# Altium project PROC054D_MMW_CAS_RF_EVM.PrjPcb (part 9 of 9)

## Sheet PROC054D_EVM_Hardware.SchDoc: HAWRdwAWRe
size 558 x 431 mm; Date: Not shown in title block; ApprovedBy: Not shown in title block; CheckedBy: Not shown in title block; Author: Not shown in title block; CompanyName: Not shown in title block; DrawnBy: a0271760; Engineer: Not shown in title block; Organization: Not shown in title block; Address1: Not shown in title block; Address2: Not shown in title block; Address3: Not shown in title block; Address4: Not shown in title block; DocumentNumber: 18; Revision: Use project pAWRameter SCH_Rev; SheetNumber: 18; SheetTotal: 19; PageSetup: Record=PageOptions|CenterHorizontal=True|CenterVertical=True|PrintScale=1.00|XCorrection=1.00|YCorrection=1.00|PrintKind=0|BorderSize=5000000|LeftOffset=0|BottomOffset=0|Orientation=2|PaperLength=1000|PaperWidth=1000|Scale=100|PaperSource=15|PrintQuality=600|MediaType=1|DitherType=10|PaperKind=Letter|PrintScaleMode=1; CurrentTime: Not shown in title block; CurrentDate: Not shown in title block; Time: Not shown in title block; DocumentFullPathAndName: Not shown in title block; DocumentName: Not shown in title block; ModifiedDate: Not shown in title block; ImagePath: Not shown in title block
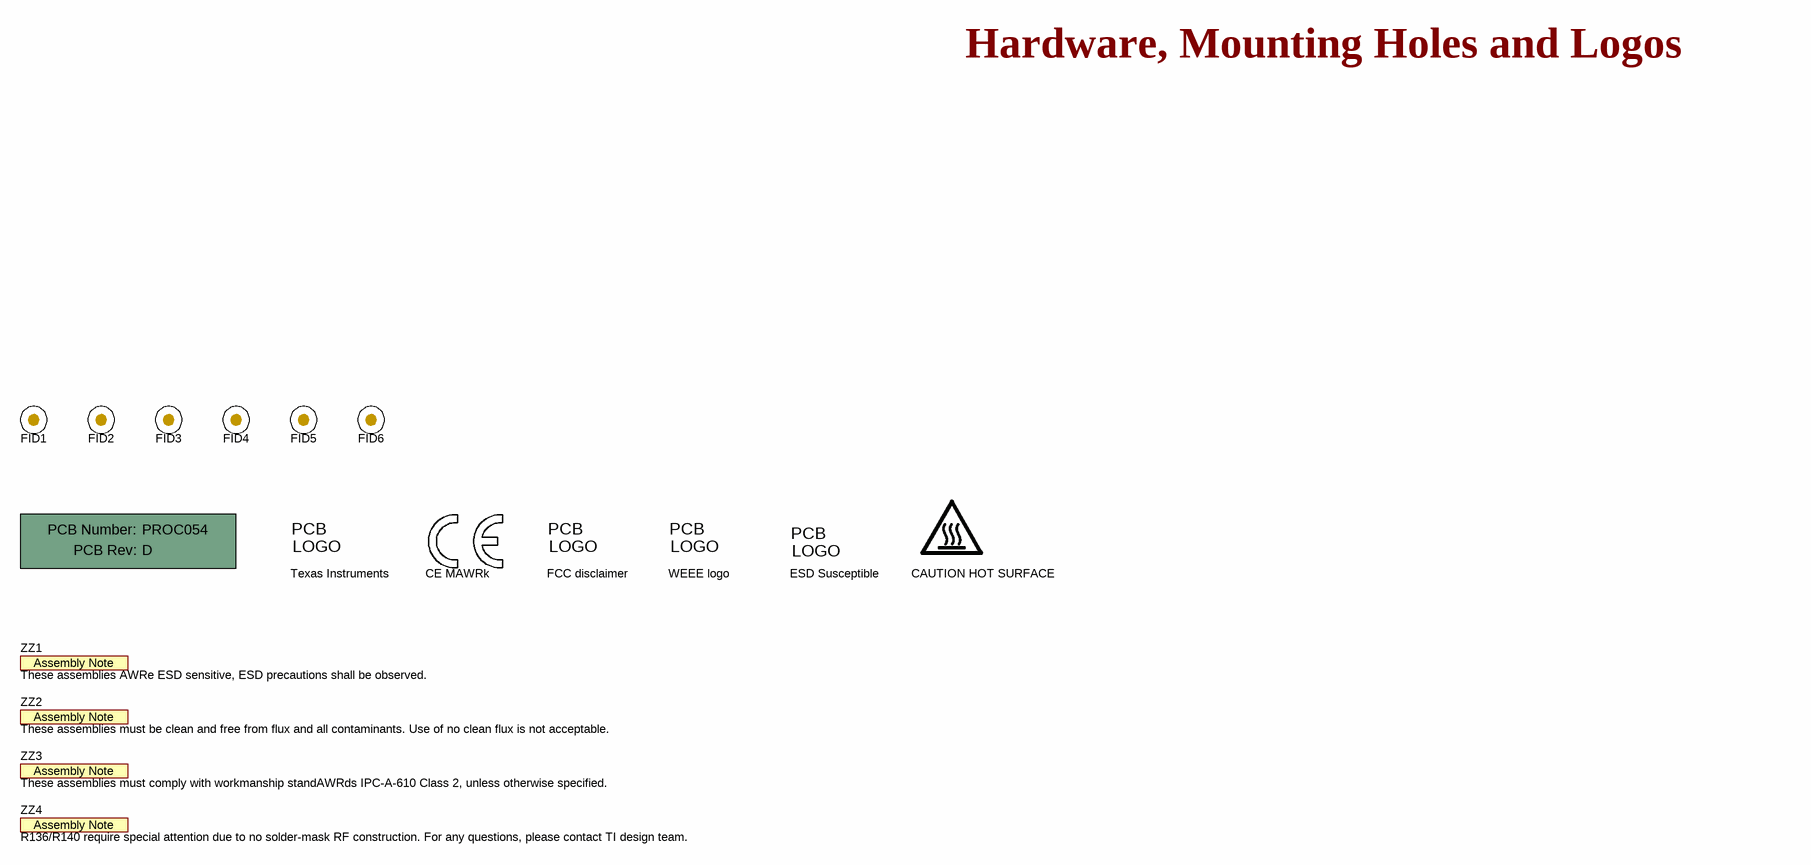
[diagram p41: PROC054D_EVM_Hardware.SchDoc]

### Parts
!PCB1  Printed Circuit Board  (value not drawn)  (mechanical)
FID1  Fiducial  [Fiducial10-20]  (value not drawn)
FID2  Fiducial  [Fiducial10-20]  (value not drawn)
FID3  Fiducial  [Fiducial10-20]  (value not drawn)
FID4  Fiducial  [Fiducial10-20]  (value not drawn)
FID5  Fiducial  [Fiducial10-20]  (value not drawn)
FID6  Fiducial  [Fiducial10-20]  (value not drawn)
Logo1  CE MAWRk  [CE_Mark_5mm]  (no BOM)
Logo2  Texas Instruments  [TI_Stacked_Overlay_Small]  (no BOM)
Logo3  FCC disclaimer  [FCC_disclaimer]  (no BOM)
Logo4  WEEE logo  [WEEE_Minimum]  (no BOM)
Logo5  ESD Susceptible  [ESD_Overlay_Large]  (no BOM)
LOGO6  CAUTION HOT SURFACE  [IEC_HotSurface_Large]  (no BOM)
ZZ1  These assemblies AWRe ESD sensitive, ESD precautions shall be observed.  [AssemblyNote]  (no BOM)
ZZ2  These assemblies must be clean and free from flux and all contaminants. Use of no clean flux is not acceptable.  [AssemblyNote]  (no BOM)
ZZ3  These assemblies must comply with workmanship standAWRds IPC-A-610 Class 2, unless otherwise specified.  [AssemblyNote]  (no BOM)
ZZ4  R136/R140 require special attention due to no solder-mask RF construction. For any questions, please contact TI design team.  [AssemblyNote]  (no BOM)

### Notes on the sheet
- Hardware, Mounting Holes and Logos
- Drawn By:
- SVN Rev:
- Number:
- TID #:
- Orderable:
- Rev:
- Sheet Title:
- File:
- Project Title:
- Designed for:
- Assembly VAWRiant:
- Mod. Date:
- Sheet:
- Size:
- of
- C
- http://www.ti.com
- Texas Instruments and/or its licensors do not wAWRrant the accuracy or completeness of this specification or any information contained therein. Texas Instruments and/or its licensors do not wAWRrant that this design will meet the specifications, will be suitable for your application or fit for any pAWRticulAWR purpose, or will operate in an implementation. Texas Instruments and/or its licensors do not wAWRrant that the design is production worthy. You should completely validate and test your design implementation to confirm the system functionality for your application.
- Engineer:
- Contact:
- © Texas Instruments
- (in symbol CMP-0003618-2) PCB Number:; PCB Rev:
- (in symbol CMP-0074769-1) PCB; LOGO
- (in symbol CMP-0074838-1) PCB; LOGO
- (in symbol CMP-0074840-1) PCB; LOGO
- (in symbol CMP-0074847-1) PCB; LOGO

### Library data of the parts
!PCB1 = CMP-0003618-2: Manufacturer: Any; PartNumber: PROC054; CompType: PCB; RoHS: O; MountType: N/A; Publisher: Texas Instruments; LatestRevisionDate: 2017-03-09; Key: PCB
FID1-FID6 = CMP-0077181-1: Fiducial mark.  There is nothing to buy or mount.; CompType: Fiducial; Manufacturer: N/A; MountType: N/A; PackageReference: N/A; PartNumber: N/A; ClassName: FiducialMark; Library Reference: Fiducial
Logo1 = CMP-0074844-1: CE Mark; SymbolCreator: a0412235; Published: 2009-03-03; Publisher: Texas Instruments; LatestRevisionDate: 2017-07-06; Lib Reference: CE Mark; PartNumber: CE Mark; Library Reference: CE Mark
Logo2 = CMP-0074838-1: Texas Instrument Corporate Signature; SymbolCreator: a0412235; Lib Reference: TI_Logo; Library Reference: Logo; SymbolVersion: 2011-08-22; Published: 2009-03-03; Publisher: Texas Instruments; ClassName: Logo; LatestRevisionDate: 2017-07-06; PartNumber: Texas Instruments
Logo3 = CMP-0074847-1: FCC_disclaimer; Library Reference: Logo; Published: 2009-03-03; Publisher: Texas Instruments; LatestRevisionDate: 2017-07-06; Lib Reference: FCC_disclaimer; PartNumber: FCC disclaimer
Logo4 = CMP-0074769-1: Library Reference: WEEE logo; Lib Reference: WEEE logo; PartNumber: WEEE logo
Logo5 = CMP-0074840-1: ESD Susceptible Symbol; SymbolCreator: a0412235; Lib Reference: ESD_Susceptible; Library Reference: Logo; Publisher: Texas Instruments; SymbolVersion: 2011-08-22; Published: 2009-03-03; LatestRevisionDate: 2017-07-06; PartNumber: ESD Susceptible
LOGO6 = CMP-0074837-1: IEC 61010-1 Hot Surface Warning; SymbolCreator: a0412235; Library Reference: IEC_HotSurface; Publisher: Texas Instruments; SymbolVersion: 2011-08-22; Published: 2009-03-03; Lib Reference: IEC_HotSurface; LatestRevisionDate: 2017-07-06; PartNumber: CAUTION HOT SURFACE
ZZ1 = CMP-0077236-1: These assemblies are ESD sensitive, ESD precautions shall be observed.; CompType: AssemblyNote; ClassName: AssemblyNote; Publisher: Texas Instruments; LatestRevisionDate: 2017-08-10; Key: AssemblyNote
ZZ2 = CMP-0077237-1: CompType: AssemblyNote; ClassName: AssemblyNote; Publisher: Texas Instruments; LatestRevisionDate: 2017-08-10; Key: AssemblyNote
ZZ3 = CMP-0077238-1: These assemblies must comply with workmanship standards IPC-A-610 Class 2, unless otherwise specified.; CompType: AssemblyNote; ClassName: AssemblyNote; Publisher: Texas Instruments; LatestRevisionDate: 2017-08-10; Key: AssemblyNote
ZZ4 = CMP-0077238-1: CompType: AssemblyNote; ClassName: AssemblyNote; Publisher: Texas Instruments; LatestRevisionDate: 2017-08-10; Key: AssemblyNote

## Sheet PROC054D_Revision_History.SchDoc: Revision History
size 558 x 431 mm; Date: Not shown in title block; ApprovedBy: Not shown in title block; CheckedBy: Not shown in title block; Author: Not shown in title block; CompanyName: Not shown in title block; DrawnBy: a0271760; Engineer: Not shown in title block; Organization: Not shown in title block; Address1: Not shown in title block; Address2: Not shown in title block; Address3: Not shown in title block; Address4: Not shown in title block; DocumentNumber: 19; Revision: Use project pAWRameter SCH_Rev; SheetNumber: 19; SheetTotal: 19; PageSetup: Record=PageOptions|CenterHorizontal=True|CenterVertical=True|PrintScale=1.00|XCorrection=1.00|YCorrection=1.00|PrintKind=0|BorderSize=5000000|LeftOffset=0|BottomOffset=0|Orientation=2|PaperLength=1000|PaperWidth=1000|Scale=100|PaperSource=15|PrintQuality=600|MediaType=1|DitherType=10|PaperKind=Letter|PrintScaleMode=1; CurrentTime: Not shown in title block; CurrentDate: Not shown in title block; Time: Not shown in title block; DocumentFullPathAndName: Not shown in title block; DocumentName: Not shown in title block; ModifiedDate: Not shown in title block; ImagePath: Not shown in title block
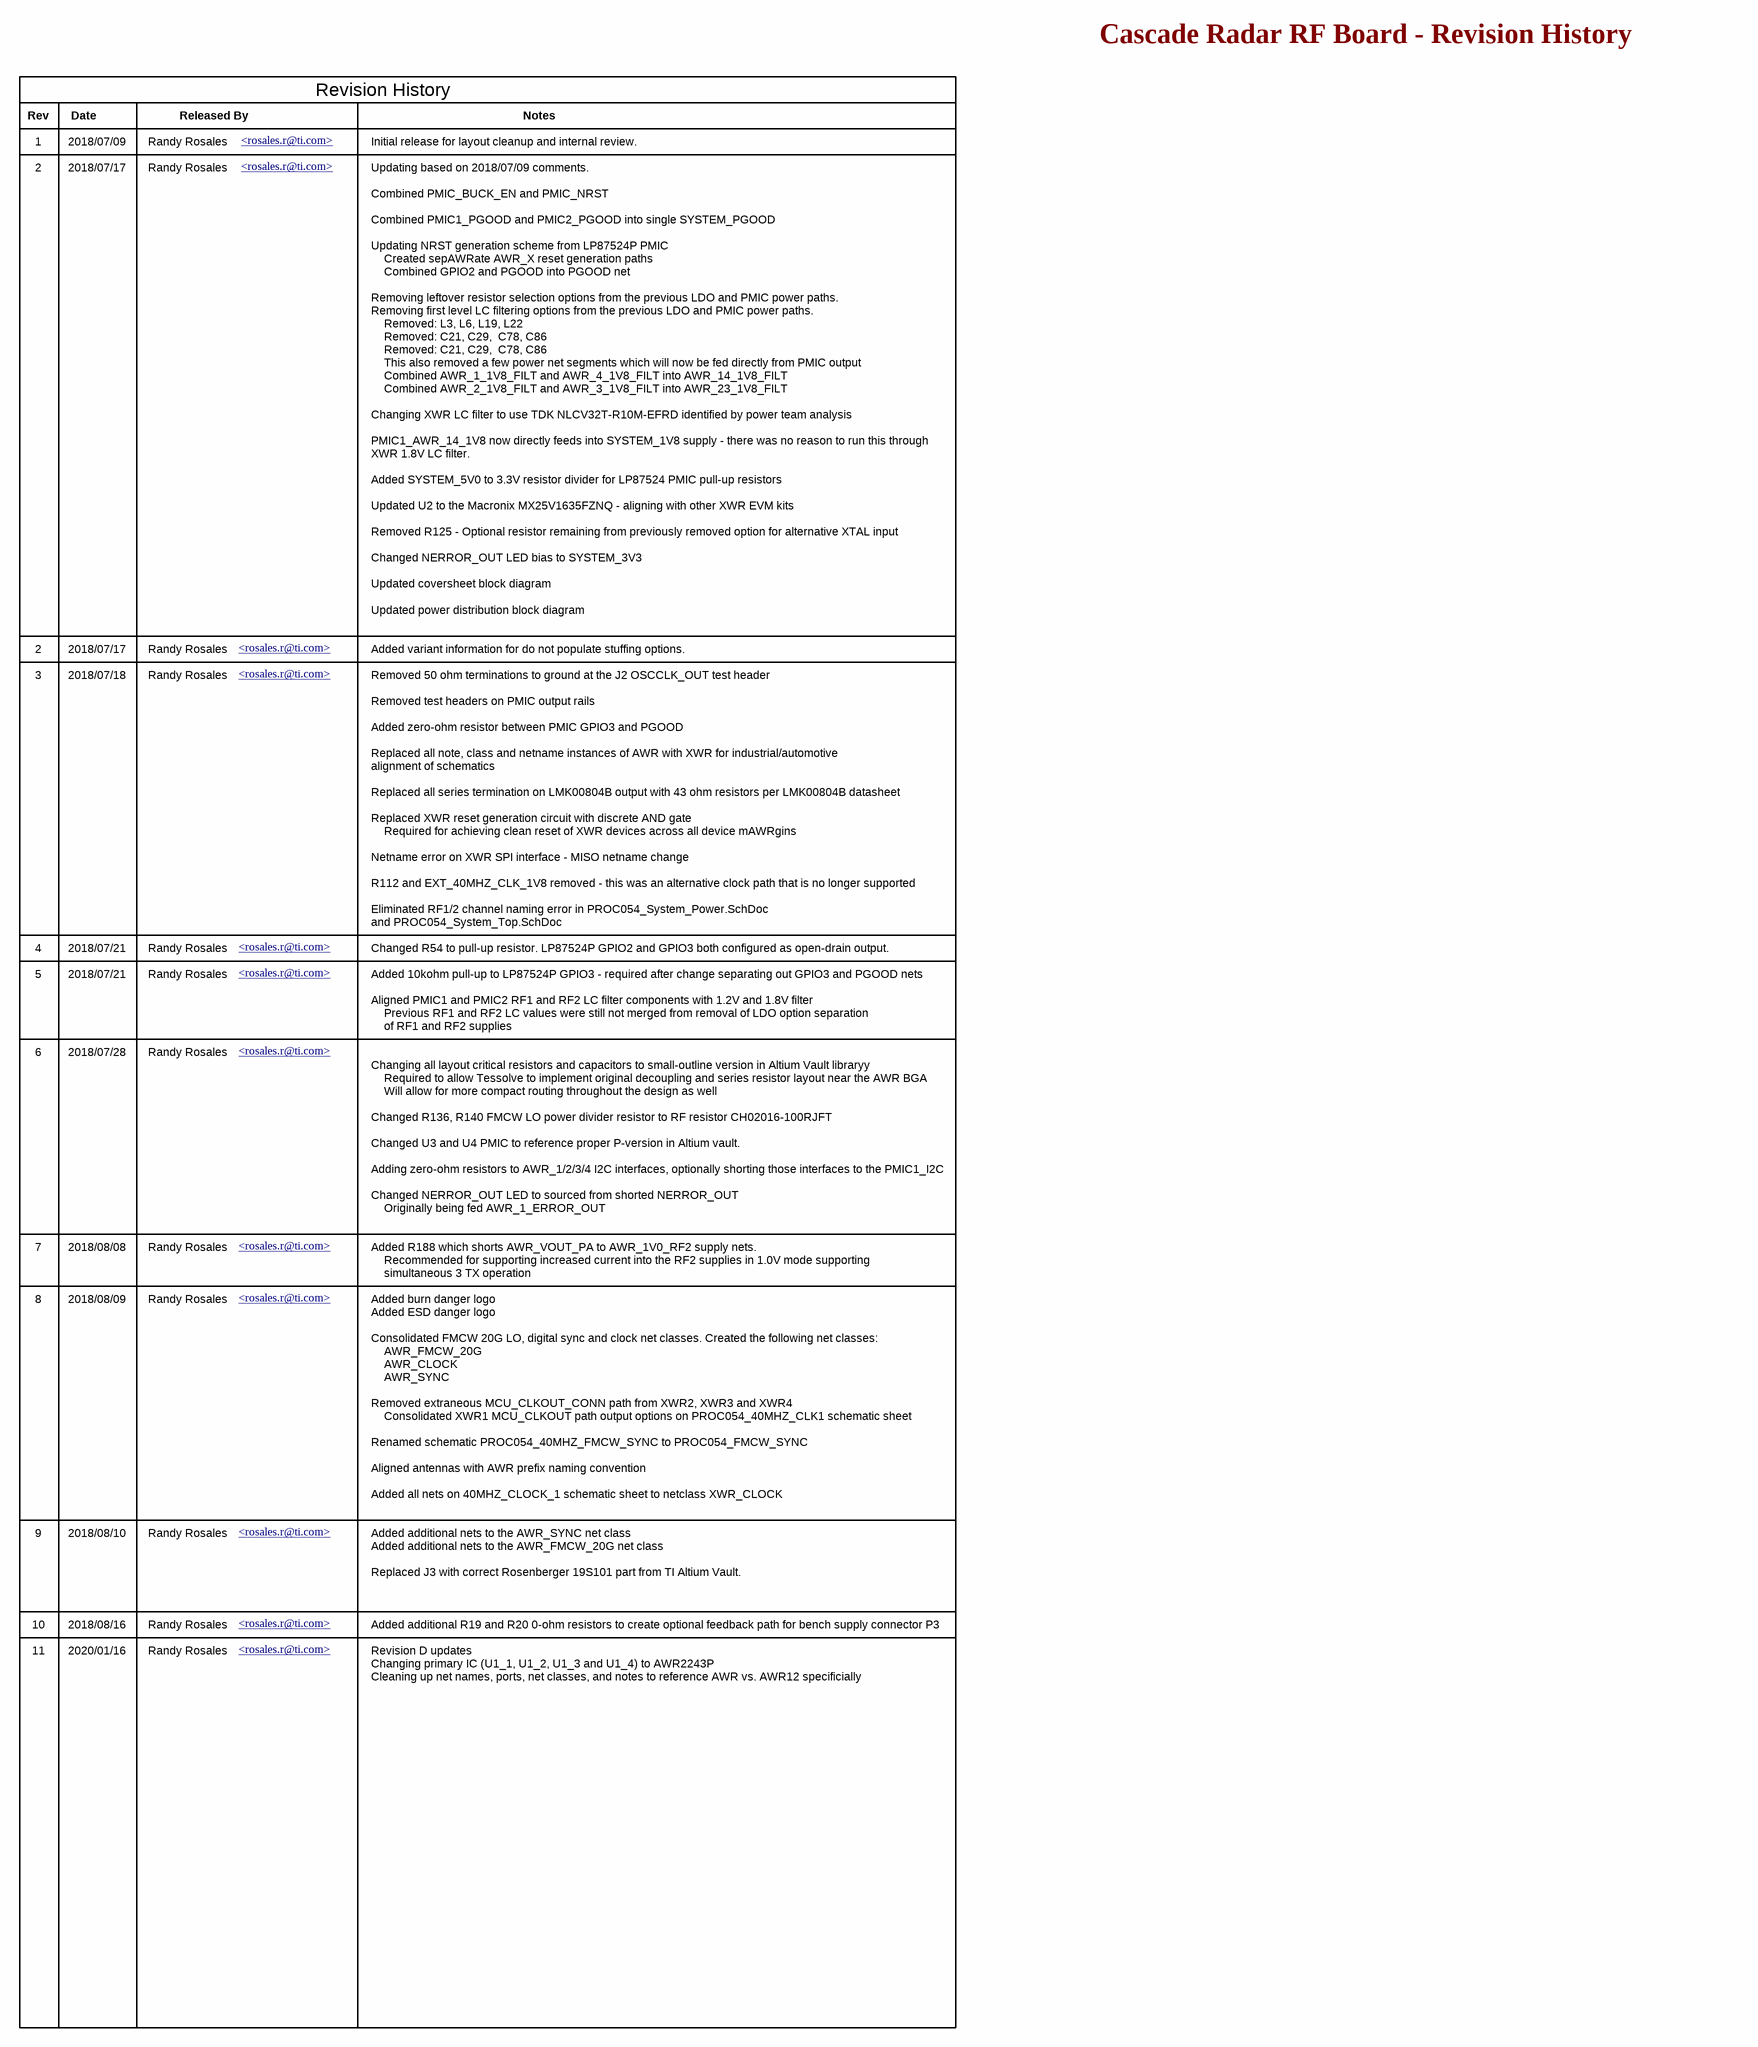
[diagram p42: PROC054D_Revision_History.SchDoc]

### Notes on the sheet
- Cascade Radar RF Board - Revision History
- Rev
- Date
- Released By
- Revision History
- Notes
- 1
- 2
- 2018/07/09
- 2018/07/17
- Randy Rosales
- <rosales.r@ti.com> <rosales.r@ti.com>
- Initial release for layout cleanup and internal review.
- Updating based on 2018/07/09 comments.
- Combined PMIC_BUCK_EN and PMIC_NRST
- Updating NRST generation scheme from LP87524P PMIC
- Combined PMIC1_PGOOD and PMIC2_PGOOD into single SYSTEM_PGOOD
- Created sepAWRate AWR_X reset generation paths
- Removing leftover resistor selection options from the previous LDO and PMIC power paths.
- Removing first level LC filtering options from the previous LDO and PMIC power paths.
- Removed: L3, L6, L19, L22
- Combined GPIO2 and PGOOD into PGOOD net
- Removed: C21, C29,  C78, C86
- This also removed a few power net segments which will now be fed directly from PMIC output
- Combined AWR_1_1V8_FILT and AWR_4_1V8_FILT into AWR_14_1V8_FILT
- Combined AWR_2_1V8_FILT and AWR_3_1V8_FILT into AWR_23_1V8_FILT
- Changing XWR LC filter to use TDK NLCV32T-R10M-EFRD identified by power team analysis
- PMIC1_AWR_14_1V8 now directly feeds into SYSTEM_1V8 supply - there was no reason to run this through
- XWR 1.8V LC filter.
- Updated U2 to the Macronix MX25V1635FZNQ - aligning with other XWR EVM kits
- Added SYSTEM_5V0 to 3.3V resistor divider for LP87524 PMIC pull-up resistors
- Removed R125 - Optional resistor remaining from previously removed option for alternative XTAL input
- Changed NERROR_OUT LED bias to SYSTEM_3V3
- Updated coversheet block diagram
- Updated power distribution block diagram
- Added variant information for do not populate stuffing options.
- 3
- 2018/07/18
- Removed 50 ohm terminations to ground at the J2 OSCCLK_OUT test header
- Removed test headers on PMIC output rails
- Added zero-ohm resistor between PMIC GPIO3 and PGOOD
- Replaced all note, class and netname instances of AWR with XWR for industrial/automotive
- alignment of schematics
- Replaced all series termination on LMK00804B output with 43 ohm resistors per LMK00804B datasheet
- Replaced XWR reset generation circuit with discrete AND gate
- Required for achieving clean reset of XWR devices across all device mAWRgins
- Netname error on XWR SPI interface - MISO netname change
- R112 and EXT_40MHZ_CLK_1V8 removed - this was an alternative clock path that is no longer supported
- Eliminated RF1/2 channel naming error in PROC054_System_Power.SchDoc
- 4
- 5
- 2018/07/21
- Changed R54 to pull-up resistor. LP87524P GPIO2 and GPIO3 both configured as open-drain output.
- and PROC054_System_Top.SchDoc
- Added 10kohm pull-up to LP87524P GPIO3 - required after change separating out GPIO3 and PGOOD nets
- Aligned PMIC1 and PMIC2 RF1 and RF2 LC filter components with 1.2V and 1.8V filter
- Previous RF1 and RF2 LC values were still not merged from removal of LDO option separation
- of RF1 and RF2 supplies
- 6
- 2018/07/28
- Changing all layout critical resistors and capacitors to small-outline version in Altium Vault libraryy
- Required to allow Tessolve to implement original decoupling and series resistor layout near the AWR BGA
- Will allow for more compact routing throughout the design as well
- Adding zero-ohm resistors to AWR_1/2/3/4 I2C interfaces, optionally shorting those interfaces to the PMIC1_I2C
- Changed R136, R140 FMCW LO power divider resistor to RF resistor CH02016-100RJFT
- Changed U3 and U4 PMIC to reference proper P-version in Altium vault.
- Changed NERROR_OUT LED to sourced from shorted NERROR_OUT
- Originally being fed AWR_1_ERROR_OUT
- 7
- 8
- 2018/08/08
- 2018/08/09
- Added R188 which shorts AWR_VOUT_PA to AWR_1V0_RF2 supply nets.
- Added burn danger logo
- Recommended for supporting increased current into the RF2 supplies in 1.0V mode supporting
- simultaneous 3 TX operation
- Added ESD danger logo
- Consolidated FMCW 20G LO, digital sync and clock net classes. Created the following net classes:
- AWR_FMCW_20G
- AWR_CLOCK
- Removed extraneous MCU_CLKOUT_CONN path from XWR2, XWR3 and XWR4
- Consolidated XWR1 MCU_CLKOUT path output options on PROC054_40MHZ_CLK1 schematic sheet
- AWR_SYNC
- Renamed schematic PROC054_40MHZ_FMCW_SYNC to PROC054_FMCW_SYNC
- Aligned antennas with AWR prefix naming convention
- Added all nets on 40MHZ_CLOCK_1 schematic sheet to netclass XWR_CLOCK
- 9
- 2018/08/10
- Added additional nets to the AWR_SYNC net class
- Added additional nets to the AWR_FMCW_20G net class
- 10
- 2018/08/16
- Replaced J3 with correct Rosenberger 19S101 part from TI Altium Vault.
- Added additional R19 and R20 0-ohm resistors to create optional feedback path for bench supply connector P3
- 11
- 2020/01/16
- Changing primary IC (U1_1, U1_2, U1_3 and U1_4) to AWR2243P
- Cleaning up net names, ports, net classes, and notes to reference AWR vs. AWR12 specificially
- Revision D updates
- Drawn By:
- SVN Rev:
- Number:
- TID #:
- Orderable:
- Rev:
- Sheet Title:
- File:
- Project Title:
- Designed for:
- Assembly VAWRiant:
- Mod. Date:
- Sheet:
- Size:
- of
- C
- http://www.ti.com
- Texas Instruments and/or its licensors do not wAWRrant the accuracy or completeness of this specification or any information contained therein. Texas Instruments and/or its licensors do not wAWRrant that this design will meet the specifications, will be suitable for your application or fit for any pAWRticulAWR purpose, or will operate in an implementation. Texas Instruments and/or its licensors do not wAWRrant that the design is production worthy. You should completely validate and test your design implementation to confirm the system functionality for your application.
- Engineer:
- Contact:
- © Texas Instruments

## Nets that join several sheets
GND: PROC054D_40MHZ_Clock (29 pins), PROC054D_FMCW_Sync (14 pins), PROC054D_SMA_SMP_Connectors (10 pins), PROC054D_Temp_Sensor (9 pins), CASCADE_RF_BOARD/AWR_1 (20 pins), CASCADE_RF_BOARD/AWR_1 (92 pins), PROC054D_System_Power (12 pins), PROC054D_AWR_1_AWR_4_LP87524P (42 pins), PROC054D_System_3V3_Supply (5 pins), PROC054D_AWR_2_AWR_3_LP87524P (40 pins), PROC054D_AWR_1_AWR_4_LC_Filtering (35 pins), PROC054D_AWR_2_AWR_3_LC_Filtering (32 pins), PROC054D_System_LED (6 pins), CASCADE_RF_BOARD/AWR_1 (R182_1.1 R183_1.1 R184_1.1 R185_1.1), PROC054D_Host_Connector (104 pins), CASCADE_RF_BOARD/AWR_2 (20 pins), CASCADE_RF_BOARD/AWR_2 (92 pins), CASCADE_RF_BOARD/AWR_2 (R182_2.1 R183_2.1 R184_2.1 R185_2.1), CASCADE_RF_BOARD/AWR_3 (92 pins), CASCADE_RF_BOARD/AWR_3 (R182_3.1 R183_3.1 R184_3.1 R185_3.1), CASCADE_RF_BOARD/AWR_3 (20 pins), CASCADE_RF_BOARD/AWR_4 (20 pins), CASCADE_RF_BOARD/AWR_4 (R182_4.1 R183_4.1 R184_4.1 R185_4.1), CASCADE_RF_BOARD/AWR_4 (92 pins)
SYSTEM_1V8: PROC054D_40MHZ_Clock (C175.1 L34.1), PROC054D_AWR_1_AWR_4_LC_Filtering (C18.1 C19.1 C20.1 R35.2)
SYSTEM_3V3: PROC054D_40MHZ_Clock (C169.1 L33.1), PROC054D_FMCW_Sync (C181.1 L35.1), PROC054D_Temp_Sensor (7 pins), CASCADE_RF_BOARD/AWR_1 (R29_1.2), CASCADE_RF_BOARD/AWR_1 (C148_1.1 U1_1#2.R13), PROC054D_System_Power (20 pins), PROC054D_AWR_1_AWR_4_LP87524P (R46.1 R47.2), PROC054D_System_3V3_Supply (C203.1 U5.1), PROC054D_AWR_2_AWR_3_LP87524P (R70.1 R71.2), PROC054D_System_LED (R193.2 R195.2), CASCADE_RF_BOARD/AWR_1 (8 pins), PROC054D_Host_Connector (R150.2), CASCADE_RF_BOARD/AWR_2 (R29_2.2), CASCADE_RF_BOARD/AWR_2 (C148_2.1 U1_2#2.R13), CASCADE_RF_BOARD/AWR_2 (8 pins), CASCADE_RF_BOARD/AWR_3 (C148_3.1 U1_3#1.R13), CASCADE_RF_BOARD/AWR_3 (8 pins), CASCADE_RF_BOARD/AWR_3 (R29_3.2), CASCADE_RF_BOARD/AWR_4 (R29_4.2), CASCADE_RF_BOARD/AWR_4 (8 pins), CASCADE_RF_BOARD/AWR_4 (C148_4.1 U1_4#2.R13)
SYSTEM_5V0: PROC054D_AWR_1_AWR_4_LP87524P (10 pins), PROC054D_System_3V3_Supply (C202.1 U5.8), PROC054D_AWR_2_AWR_3_LP87524P (10 pins), PROC054D_System_LED (6 pins), PROC054D_Host_Connector (12 pins)
AWR_1_DIG_SYNCOUT: PROC054D_FMCW_Sync (R143.1), PROC054D_Host_Connector (R148.1)
AWR_1_MCU_CLKOUT: PROC054D_40MHZ_Clock (R213.1 R214.1), PROC054D_Host_Connector (J4.2)
AWR_1_NRST: PROC054D_System_Power (R208.2), PROC054D_System_LED (R198.2), PROC054D_Host_Connector (J4.85)
AWR_1_OSC_CLKOUT: PROC054D_40MHZ_Clock (R107.1), PROC054D_SMA_SMP_Connectors (R186.1)
AWR_1V0_RF1: CASCADE_RF_BOARD/AWR_1 (7 pins), CASCADE_RF_BOARD/AWR_2 (7 pins), CASCADE_RF_BOARD/AWR_3 (7 pins), CASCADE_RF_BOARD/AWR_4 (7 pins)
AWR_1V0_RF2: CASCADE_RF_BOARD/AWR_1 (R188_1.2), CASCADE_RF_BOARD/AWR_1 (C140_1.1 C141_1.1 U1_1#2.C2 U1_1#2.D2), CASCADE_RF_BOARD/AWR_2 (R188_2.2), CASCADE_RF_BOARD/AWR_2 (C140_2.1 C141_2.1 U1_2#2.C2 U1_2#2.D2), CASCADE_RF_BOARD/AWR_3 (C140_3.1 C141_3.1 U1_3#1.C2 U1_3#1.D2), CASCADE_RF_BOARD/AWR_3 (R188_3.2), CASCADE_RF_BOARD/AWR_4 (R188_4.2), CASCADE_RF_BOARD/AWR_4 (C140_4.1 C141_4.1 U1_4#2.C2 U1_4#2.D2)
AWR_1V2: CASCADE_RF_BOARD/AWR_1 (12 pins), CASCADE_RF_BOARD/AWR_2 (12 pins), CASCADE_RF_BOARD/AWR_3 (12 pins), CASCADE_RF_BOARD/AWR_4 (12 pins)
AWR_1V8: CASCADE_RF_BOARD/AWR_1 (14 pins), CASCADE_RF_BOARD/AWR_2 (14 pins), CASCADE_RF_BOARD/AWR_3 (14 pins), CASCADE_RF_BOARD/AWR_4 (14 pins)
AWR_2_NRST: PROC054D_System_Power (R209.2), PROC054D_System_LED (R199.2), PROC054D_Host_Connector (J4.109)
AWR_3_NRST: PROC054D_System_Power (R211.2), PROC054D_System_LED (R202.2), PROC054D_Host_Connector (J5.36)
AWR_3_OSC_CLKOUT: PROC054D_40MHZ_Clock (R109.1), PROC054D_SMA_SMP_Connectors (R187.1)
AWR_4_NRST: PROC054D_System_Power (R210.2), PROC054D_System_LED (R203.2), PROC054D_Host_Connector (J5.12)
BSS_LOGGER: CASCADE_RF_BOARD/AWR_1 (R14_1.1), CASCADE_RF_BOARD/AWR_2 (R14_2.1), CASCADE_RF_BOARD/AWR_3 (R14_3.1), CASCADE_RF_BOARD/AWR_4 (R14_4.1)
CSI2_CLK_N: CASCADE_RF_BOARD/AWR_1 (U1_1#1.J14), CASCADE_RF_BOARD/AWR_2 (U1_2#1.J14), CASCADE_RF_BOARD/AWR_3 (U1_3#2.J14), CASCADE_RF_BOARD/AWR_4 (U1_4#1.J14)
CSI2_CLK_P: CASCADE_RF_BOARD/AWR_1 (U1_1#1.J15), CASCADE_RF_BOARD/AWR_2 (U1_2#1.J15), CASCADE_RF_BOARD/AWR_3 (U1_3#2.J15), CASCADE_RF_BOARD/AWR_4 (U1_4#1.J15)
CSI2_TX0_N: CASCADE_RF_BOARD/AWR_1 (U1_1#1.G14), CASCADE_RF_BOARD/AWR_2 (U1_2#1.G14), CASCADE_RF_BOARD/AWR_3 (U1_3#2.G14), CASCADE_RF_BOARD/AWR_4 (U1_4#1.G14)
CSI2_TX0_P: CASCADE_RF_BOARD/AWR_1 (U1_1#1.G15), CASCADE_RF_BOARD/AWR_2 (U1_2#1.G15), CASCADE_RF_BOARD/AWR_3 (U1_3#2.G15), CASCADE_RF_BOARD/AWR_4 (U1_4#1.G15)
CSI2_TX1_N: CASCADE_RF_BOARD/AWR_1 (U1_1#1.H14), CASCADE_RF_BOARD/AWR_2 (U1_2#1.H14), CASCADE_RF_BOARD/AWR_3 (U1_3#2.H14), CASCADE_RF_BOARD/AWR_4 (U1_4#1.H14)
CSI2_TX1_P: CASCADE_RF_BOARD/AWR_1 (U1_1#1.H15), CASCADE_RF_BOARD/AWR_2 (U1_2#1.H15), CASCADE_RF_BOARD/AWR_3 (U1_3#2.H15), CASCADE_RF_BOARD/AWR_4 (U1_4#1.H15)
CSI2_TX2_N: CASCADE_RF_BOARD/AWR_1 (U1_1#1.K14), CASCADE_RF_BOARD/AWR_2 (U1_2#1.K14), CASCADE_RF_BOARD/AWR_3 (U1_3#2.K14), CASCADE_RF_BOARD/AWR_4 (U1_4#1.K14)
CSI2_TX2_P: CASCADE_RF_BOARD/AWR_1 (U1_1#1.K15), CASCADE_RF_BOARD/AWR_2 (U1_2#1.K15), CASCADE_RF_BOARD/AWR_3 (U1_3#2.K15), CASCADE_RF_BOARD/AWR_4 (U1_4#1.K15)
CSI2_TX3_N: CASCADE_RF_BOARD/AWR_1 (U1_1#1.L14), CASCADE_RF_BOARD/AWR_2 (U1_2#1.L14), CASCADE_RF_BOARD/AWR_3 (U1_3#2.L14), CASCADE_RF_BOARD/AWR_4 (U1_4#1.L14)
CSI2_TX3_P: CASCADE_RF_BOARD/AWR_1 (U1_1#1.L15), CASCADE_RF_BOARD/AWR_2 (U1_2#1.L15), CASCADE_RF_BOARD/AWR_3 (U1_3#2.L15), CASCADE_RF_BOARD/AWR_4 (U1_4#1.L15)
DIG_SYNCIN: CASCADE_RF_BOARD/AWR_1 (U1_1#1.N10), CASCADE_RF_BOARD/AWR_1 (R185_1.2), CASCADE_RF_BOARD/AWR_2 (U1_2#1.N10), CASCADE_RF_BOARD/AWR_2 (R185_2.2), CASCADE_RF_BOARD/AWR_3 (R185_3.2), CASCADE_RF_BOARD/AWR_3 (U1_3#2.N10), CASCADE_RF_BOARD/AWR_4 (U1_4#1.N10), CASCADE_RF_BOARD/AWR_4 (R185_4.2)
DIG_SYNCOUT: CASCADE_RF_BOARD/AWR_1 (R1_1.1 TP1_1.1), CASCADE_RF_BOARD/AWR_2 (R1_2.1 TP1_2.1), CASCADE_RF_BOARD/AWR_3 (R1_3.1 TP1_3.1), CASCADE_RF_BOARD/AWR_4 (R1_4.1 TP1_4.1)
EXT_DIG_SYNC: PROC054D_FMCW_Sync (R142.1), PROC054D_Host_Connector (J4.64)
FMCW_CLKOUT: CASCADE_RF_BOARD/AWR_1 (U1_1#1.B15), CASCADE_RF_BOARD/AWR_2 (U1_2#1.B15), CASCADE_RF_BOARD/AWR_3 (U1_3#2.B15), CASCADE_RF_BOARD/AWR_4 (U1_4#1.B15)
FMCW_SYNCIN1: CASCADE_RF_BOARD/AWR_1 (U1_1#1.B1), CASCADE_RF_BOARD/AWR_2 (U1_2#1.B1), CASCADE_RF_BOARD/AWR_3 (U1_3#2.B1), CASCADE_RF_BOARD/AWR_4 (U1_4#1.B1)
FMCW_SYNCOUT: CASCADE_RF_BOARD/AWR_1 (U1_1#1.D1), CASCADE_RF_BOARD/AWR_2 (U1_2#1.D1), CASCADE_RF_BOARD/AWR_3 (U1_3#2.D1), CASCADE_RF_BOARD/AWR_4 (U1_4#1.D1)
GPIO_0: CASCADE_RF_BOARD/AWR_1 (R16_1.2 U1_1#1.N4), CASCADE_RF_BOARD/AWR_2 (R16_2.2 U1_2#1.N4), CASCADE_RF_BOARD/AWR_3 (R16_3.2 U1_3#2.N4), CASCADE_RF_BOARD/AWR_4 (R16_4.2 U1_4#1.N4)
GPIO_1: CASCADE_RF_BOARD/AWR_1 (R17_1.2 U1_1#1.N7), CASCADE_RF_BOARD/AWR_2 (R17_2.2 U1_2#1.N7), CASCADE_RF_BOARD/AWR_3 (R17_3.2 U1_3#2.N7), CASCADE_RF_BOARD/AWR_4 (R17_4.2 U1_4#1.N7)
GPIO_2: CASCADE_RF_BOARD/AWR_1 (R18_1.2 U1_1#1.N13), CASCADE_RF_BOARD/AWR_2 (R18_2.2 U1_2#1.N13), CASCADE_RF_BOARD/AWR_3 (R18_3.2 U1_3#2.N13), CASCADE_RF_BOARD/AWR_4 (R18_4.2 U1_4#1.N13)
LVDS_FRCLK_N: CASCADE_RF_BOARD/AWR_1 (U1_1#1.M14), CASCADE_RF_BOARD/AWR_2 (U1_2#1.M14), CASCADE_RF_BOARD/AWR_3 (U1_3#2.M14), CASCADE_RF_BOARD/AWR_4 (U1_4#1.M14)
LVDS_FRCLK_P: CASCADE_RF_BOARD/AWR_1 (U1_1#1.M15), CASCADE_RF_BOARD/AWR_2 (U1_2#1.M15), CASCADE_RF_BOARD/AWR_3 (U1_3#2.M15), CASCADE_RF_BOARD/AWR_4 (U1_4#1.M15)
LVDS_VALID_N: CASCADE_RF_BOARD/AWR_1 (U1_1#1.N14), CASCADE_RF_BOARD/AWR_2 (U1_2#1.N14), CASCADE_RF_BOARD/AWR_3 (U1_3#2.N14), CASCADE_RF_BOARD/AWR_4 (U1_4#1.N14)
LVDS_VALID_P: CASCADE_RF_BOARD/AWR_1 (U1_1#1.N15), CASCADE_RF_BOARD/AWR_2 (U1_2#1.N15), CASCADE_RF_BOARD/AWR_3 (U1_3#2.N15), CASCADE_RF_BOARD/AWR_4 (U1_4#1.N15)
MCU_CLKOUT: CASCADE_RF_BOARD/AWR_1 (R5_1.1), CASCADE_RF_BOARD/AWR_2 (R5_2.1), CASCADE_RF_BOARD/AWR_3 (R5_3.1), CASCADE_RF_BOARD/AWR_4 (R5_4.1)
MSS_LOGGER: CASCADE_RF_BOARD/AWR_1 (R15_1.1), CASCADE_RF_BOARD/AWR_2 (R15_2.1), CASCADE_RF_BOARD/AWR_3 (R15_3.1), CASCADE_RF_BOARD/AWR_4 (R15_4.1)
NERROR_IN: CASCADE_RF_BOARD/AWR_1 (U1_1#1.P7), CASCADE_RF_BOARD/AWR_1 (R177_1.1), CASCADE_RF_BOARD/AWR_2 (U1_2#1.P7), CASCADE_RF_BOARD/AWR_2 (R177_2.1), CASCADE_RF_BOARD/AWR_3 (R177_3.1), CASCADE_RF_BOARD/AWR_3 (U1_3#2.P7), CASCADE_RF_BOARD/AWR_4 (U1_4#1.P7), CASCADE_RF_BOARD/AWR_4 (R177_4.1)
NERROR_OUT: CASCADE_RF_BOARD/AWR_1 (R9_1.1), PROC054D_System_LED (DS2.2), PROC054D_Host_Connector (6 pins), CASCADE_RF_BOARD/AWR_2 (R9_2.1), CASCADE_RF_BOARD/AWR_3 (R9_3.1), CASCADE_RF_BOARD/AWR_4 (R9_4.1)
NRST: CASCADE_RF_BOARD/AWR_1 (U1_1#1.P12), CASCADE_RF_BOARD/AWR_2 (U1_2#1.P12), CASCADE_RF_BOARD/AWR_3 (U1_3#2.P12), CASCADE_RF_BOARD/AWR_4 (U1_4#1.P12)
OSC_CLKOUT: CASCADE_RF_BOARD/AWR_1 (R2_1.1), CASCADE_RF_BOARD/AWR_2 (R2_2.1), CASCADE_RF_BOARD/AWR_3 (R2_3.1), CASCADE_RF_BOARD/AWR_4 (R2_4.1)
PMIC1_AWR_1_1V0: PROC054D_AWR_1_AWR_4_LP87524P (C61.1 C62.1 L13.2 R43.1), PROC054D_AWR_1_AWR_4_LC_Filtering (C25.1 C27.1 L4.1 L5.1)
PMIC1_AWR_4_1V0: PROC054D_AWR_1_AWR_4_LP87524P (C66.1 C67.1 L15.2 R48.1), PROC054D_AWR_1_AWR_4_LC_Filtering (C33.1 C35.1 L7.1 L8.1)
PMIC1_AWR_14_1V2: PROC054D_AWR_1_AWR_4_LP87524P (C64.1 C65.1 L14.2 R45.1), PROC054D_AWR_1_AWR_4_LC_Filtering (C10.1 C161.1 L1.1 L3.1)
PMIC1_AWR_14_1V8: PROC054D_AWR_1_AWR_4_LP87524P (C68.1 C69.1 L16.2 R52.1), PROC054D_AWR_1_AWR_4_LC_Filtering (5 pins)
PMIC1_SCL: PROC054D_AWR_1_AWR_4_LP87524P (R47.1 TP9.1 U3.5), PROC054D_Host_Connector (5 pins)
PMIC1_SDA: PROC054D_AWR_1_AWR_4_LP87524P (R46.2 TP10.1 U3.6), PROC054D_Host_Connector (5 pins)
PMIC2_AWR_2_1V0: PROC054D_AWR_2_AWR_3_LP87524P (C119.1 C120.1 L29.2 R67.1), PROC054D_AWR_2_AWR_3_LC_Filtering (C82.1 C84.1 L20.1 L21.1)
PMIC2_AWR_3_1V0: PROC054D_AWR_2_AWR_3_LP87524P (C124.1 C125.1 L31.2 R72.1), PROC054D_AWR_2_AWR_3_LC_Filtering (C90.1 C92.1 L23.1 L24.1)
PMIC2_AWR_23_1V2: PROC054D_AWR_2_AWR_3_LP87524P (C122.1 C123.1 L30.2 R69.1), PROC054D_AWR_2_AWR_3_LC_Filtering (C70.1 C153.1 L17.1 L19.1)
PMIC2_AWR_23_1V8: PROC054D_AWR_2_AWR_3_LP87524P (C126.1 C127.1 L32.2 R76.1), PROC054D_AWR_2_AWR_3_LC_Filtering (C74.1 C157.1 L18.1 L22.1)
PMIC2_TMPSNS_SCL: PROC054D_Temp_Sensor (R170.2), PROC054D_AWR_2_AWR_3_LP87524P (R71.1 TP26.1 U4.5), PROC054D_Host_Connector (J5.49)
PMIC2_TMPSNS_SDA: PROC054D_Temp_Sensor (R169.2), PROC054D_AWR_2_AWR_3_LP87524P (R70.2 TP27.1 U4.6), PROC054D_Host_Connector (J5.48)
PMIC_BUCK_EN: PROC054D_AWR_1_AWR_4_LP87524P (R49.1 R55.2 TP6.1 U3.7), PROC054D_AWR_2_AWR_3_LP87524P (TP23.1 U4.7)
PMIC_CLKOUT: CASCADE_RF_BOARD/AWR_1 (R4_1.1 TP2_1.1), CASCADE_RF_BOARD/AWR_2 (R4_2.1 TP2_2.1), CASCADE_RF_BOARD/AWR_3 (R4_3.1 TP2_3.1), CASCADE_RF_BOARD/AWR_4 (R4_4.1 TP2_4.1)
PMIC_NRST: PROC054D_AWR_1_AWR_4_LP87524P (R51.1 R58.2 TP4.1 U3.20), PROC054D_AWR_2_AWR_3_LP87524P (TP21.1 U4.20), PROC054D_Host_Connector (R146.1)
SCL: CASCADE_RF_BOARD/AWR_1 (U1_1#1.P4), CASCADE_RF_BOARD/AWR_1 (R180_1.1), CASCADE_RF_BOARD/AWR_2 (U1_2#1.P4), CASCADE_RF_BOARD/AWR_2 (R180_2.1), CASCADE_RF_BOARD/AWR_3 (R180_3.1), CASCADE_RF_BOARD/AWR_3 (U1_3#2.P4), CASCADE_RF_BOARD/AWR_4 (U1_4#1.P4), CASCADE_RF_BOARD/AWR_4 (R180_4.1)
SDA: CASCADE_RF_BOARD/AWR_1 (R13_1.1), CASCADE_RF_BOARD/AWR_1 (R181_1.1), CASCADE_RF_BOARD/AWR_2 (R13_2.1), CASCADE_RF_BOARD/AWR_2 (R181_2.1), CASCADE_RF_BOARD/AWR_3 (R181_3.1), CASCADE_RF_BOARD/AWR_3 (R13_3.1), CASCADE_RF_BOARD/AWR_4 (R13_4.1), CASCADE_RF_BOARD/AWR_4 (R181_4.1)
SPI_CLK1: CASCADE_RF_BOARD/AWR_1 (U1_1#1.R9), CASCADE_RF_BOARD/AWR_1 (R182_1.2), CASCADE_RF_BOARD/AWR_2 (U1_2#1.R9), CASCADE_RF_BOARD/AWR_2 (R182_2.2), CASCADE_RF_BOARD/AWR_3 (R182_3.2), CASCADE_RF_BOARD/AWR_3 (U1_3#2.R9), CASCADE_RF_BOARD/AWR_4 (U1_4#1.R9), CASCADE_RF_BOARD/AWR_4 (R182_4.2)
SPI_CS1: CASCADE_RF_BOARD/AWR_1 (U1_1#1.R7), CASCADE_RF_BOARD/AWR_1 (R175_1.1), CASCADE_RF_BOARD/AWR_2 (U1_2#1.R7), CASCADE_RF_BOARD/AWR_2 (R175_2.1), CASCADE_RF_BOARD/AWR_3 (R175_3.1), CASCADE_RF_BOARD/AWR_3 (U1_3#2.R7), CASCADE_RF_BOARD/AWR_4 (U1_4#1.R7), CASCADE_RF_BOARD/AWR_4 (R175_4.1)
SPI_HOST_INTR1: CASCADE_RF_BOARD/AWR_1 (R10_1.2), CASCADE_RF_BOARD/AWR_1 (R184_1.2), CASCADE_RF_BOARD/AWR_2 (R10_2.2), CASCADE_RF_BOARD/AWR_2 (R184_2.2), CASCADE_RF_BOARD/AWR_3 (R184_3.2), CASCADE_RF_BOARD/AWR_3 (R10_3.2), CASCADE_RF_BOARD/AWR_4 (R10_4.2), CASCADE_RF_BOARD/AWR_4 (R184_4.2)
SPI_MISO1: CASCADE_RF_BOARD/AWR_1 (R12_1.2), CASCADE_RF_BOARD/AWR_1 (R176_1.1), CASCADE_RF_BOARD/AWR_2 (R12_2.2), CASCADE_RF_BOARD/AWR_2 (R176_2.1), CASCADE_RF_BOARD/AWR_3 (R176_3.1), CASCADE_RF_BOARD/AWR_3 (R12_3.2), CASCADE_RF_BOARD/AWR_4 (R12_4.2), CASCADE_RF_BOARD/AWR_4 (R176_4.1)
SPI_MOSI1: CASCADE_RF_BOARD/AWR_1 (U1_1#1.R8), CASCADE_RF_BOARD/AWR_1 (R183_1.2), CASCADE_RF_BOARD/AWR_2 (U1_2#1.R8), CASCADE_RF_BOARD/AWR_2 (R183_2.2), CASCADE_RF_BOARD/AWR_3 (R183_3.2), CASCADE_RF_BOARD/AWR_3 (U1_3#2.R8), CASCADE_RF_BOARD/AWR_4 (U1_4#1.R8), CASCADE_RF_BOARD/AWR_4 (R183_4.2)
SYSTEM_PGOOD: PROC054D_System_Power (6 pins), PROC054D_Host_Connector (J5.119)
TCK: CASCADE_RF_BOARD/AWR_1 (U1_1#1.M13), CASCADE_RF_BOARD/AWR_2 (U1_2#1.M13), CASCADE_RF_BOARD/AWR_3 (U1_3#2.M13), CASCADE_RF_BOARD/AWR_4 (U1_4#1.M13)
TDI: CASCADE_RF_BOARD/AWR_1 (U1_1#1.H13), CASCADE_RF_BOARD/AWR_2 (U1_2#1.H13), CASCADE_RF_BOARD/AWR_3 (U1_3#2.H13), CASCADE_RF_BOARD/AWR_4 (U1_4#1.H13)
TDO: CASCADE_RF_BOARD/AWR_1 (R8_1.2 TP3_1.1), CASCADE_RF_BOARD/AWR_2 (R8_2.2 TP3_2.1), CASCADE_RF_BOARD/AWR_3 (R8_3.2 TP3_3.1), CASCADE_RF_BOARD/AWR_4 (R8_4.2 TP3_4.1)
TMPSNS_ALERT: PROC054D_Temp_Sensor (R171.2), PROC054D_Host_Connector (J5.57)
TMS: CASCADE_RF_BOARD/AWR_1 (U1_1#1.L13), CASCADE_RF_BOARD/AWR_2 (U1_2#1.L13), CASCADE_RF_BOARD/AWR_3 (U1_3#2.L13), CASCADE_RF_BOARD/AWR_4 (U1_4#1.L13)
UART_RX: CASCADE_RF_BOARD/AWR_1 (U1_1#1.N5), CASCADE_RF_BOARD/AWR_1 (R179_1.1), CASCADE_RF_BOARD/AWR_2 (U1_2#1.N5), CASCADE_RF_BOARD/AWR_2 (R179_2.1), CASCADE_RF_BOARD/AWR_3 (R179_3.1), CASCADE_RF_BOARD/AWR_3 (U1_3#2.N5), CASCADE_RF_BOARD/AWR_4 (U1_4#1.N5), CASCADE_RF_BOARD/AWR_4 (R179_4.1)
UART_TX: CASCADE_RF_BOARD/AWR_1 (R11_1.1), CASCADE_RF_BOARD/AWR_1 (R178_1.1), CASCADE_RF_BOARD/AWR_2 (R11_2.1), CASCADE_RF_BOARD/AWR_2 (R178_2.1), CASCADE_RF_BOARD/AWR_3 (R178_3.1), CASCADE_RF_BOARD/AWR_3 (R11_3.1), CASCADE_RF_BOARD/AWR_4 (R11_4.1), CASCADE_RF_BOARD/AWR_4 (R178_4.1)
WARM_RST: CASCADE_RF_BOARD/AWR_1 (U1_1#1.N12), CASCADE_RF_BOARD/AWR_1 (R174_1.1), CASCADE_RF_BOARD/AWR_2 (U1_2#1.N12), CASCADE_RF_BOARD/AWR_2 (R174_2.1), CASCADE_RF_BOARD/AWR_3 (R174_3.1), CASCADE_RF_BOARD/AWR_3 (U1_3#2.N12), CASCADE_RF_BOARD/AWR_4 (U1_4#1.N12), CASCADE_RF_BOARD/AWR_4 (R174_4.1)
XTAL_CLKM: CASCADE_RF_BOARD/AWR_1 (U1_1#1.F14), CASCADE_RF_BOARD/AWR_2 (U1_2#1.F14), CASCADE_RF_BOARD/AWR_3 (U1_3#2.F14), CASCADE_RF_BOARD/AWR_4 (U1_4#1.F14)
XTAL_CLKP: CASCADE_RF_BOARD/AWR_1 (U1_1#1.E14), CASCADE_RF_BOARD/AWR_2 (U1_2#1.E14), CASCADE_RF_BOARD/AWR_3 (U1_3#2.E14), CASCADE_RF_BOARD/AWR_4 (U1_4#1.E14)

## Assembly variants
001: not fitted C40 C41 C45 C46 C52 C53 C57 C58 C98 C99 C103 C104 C110 C111 C115 C116 FID1 FID2 FID3 FID4 FID5 FID6 J1_1 J1_2 J1_3 J1_4 J2 J3 R19 R20 R55 R58 R98 R99 R100 R101 R102 R109 R111 R112 R113 R114 R116 R117 R123 R124 R125 R127 R128 R142 R167 R168 R186 R187 R213